# EAGLE design EasyBMS (EAGLE 9.6.2)
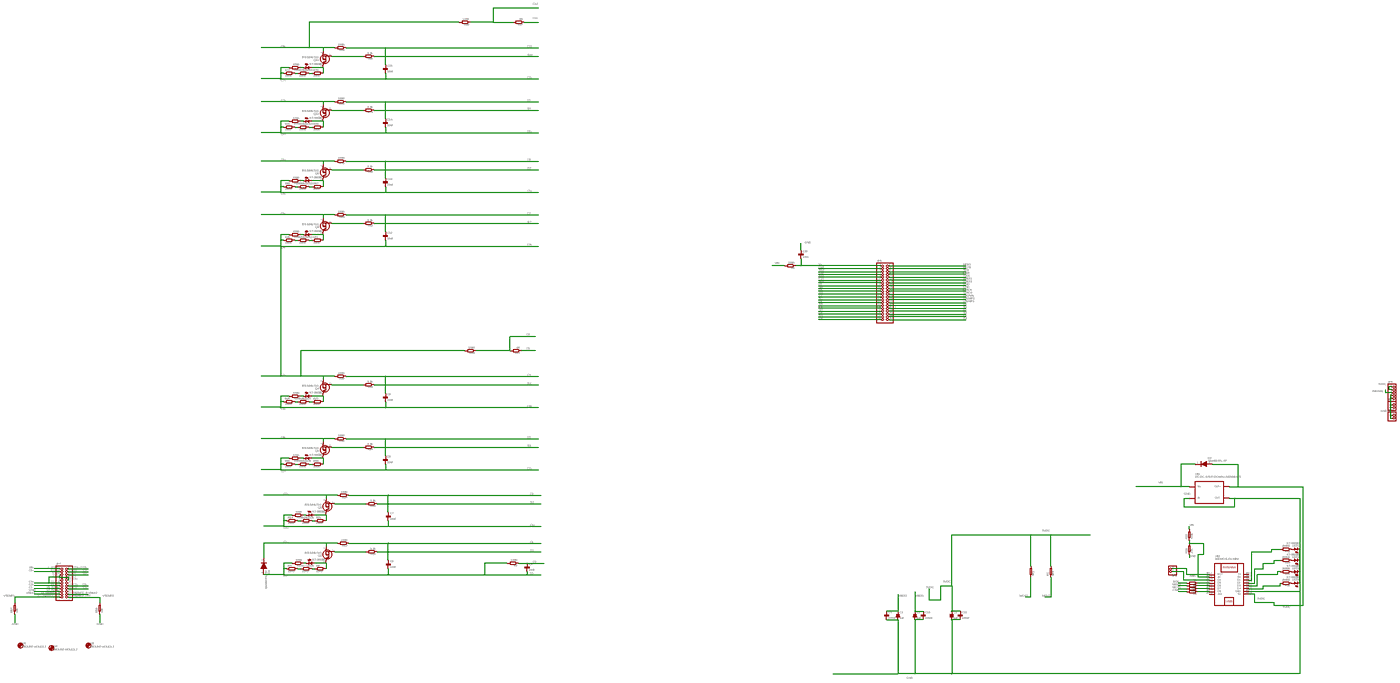
[diagram p0: schematic, sheet 1, overview]
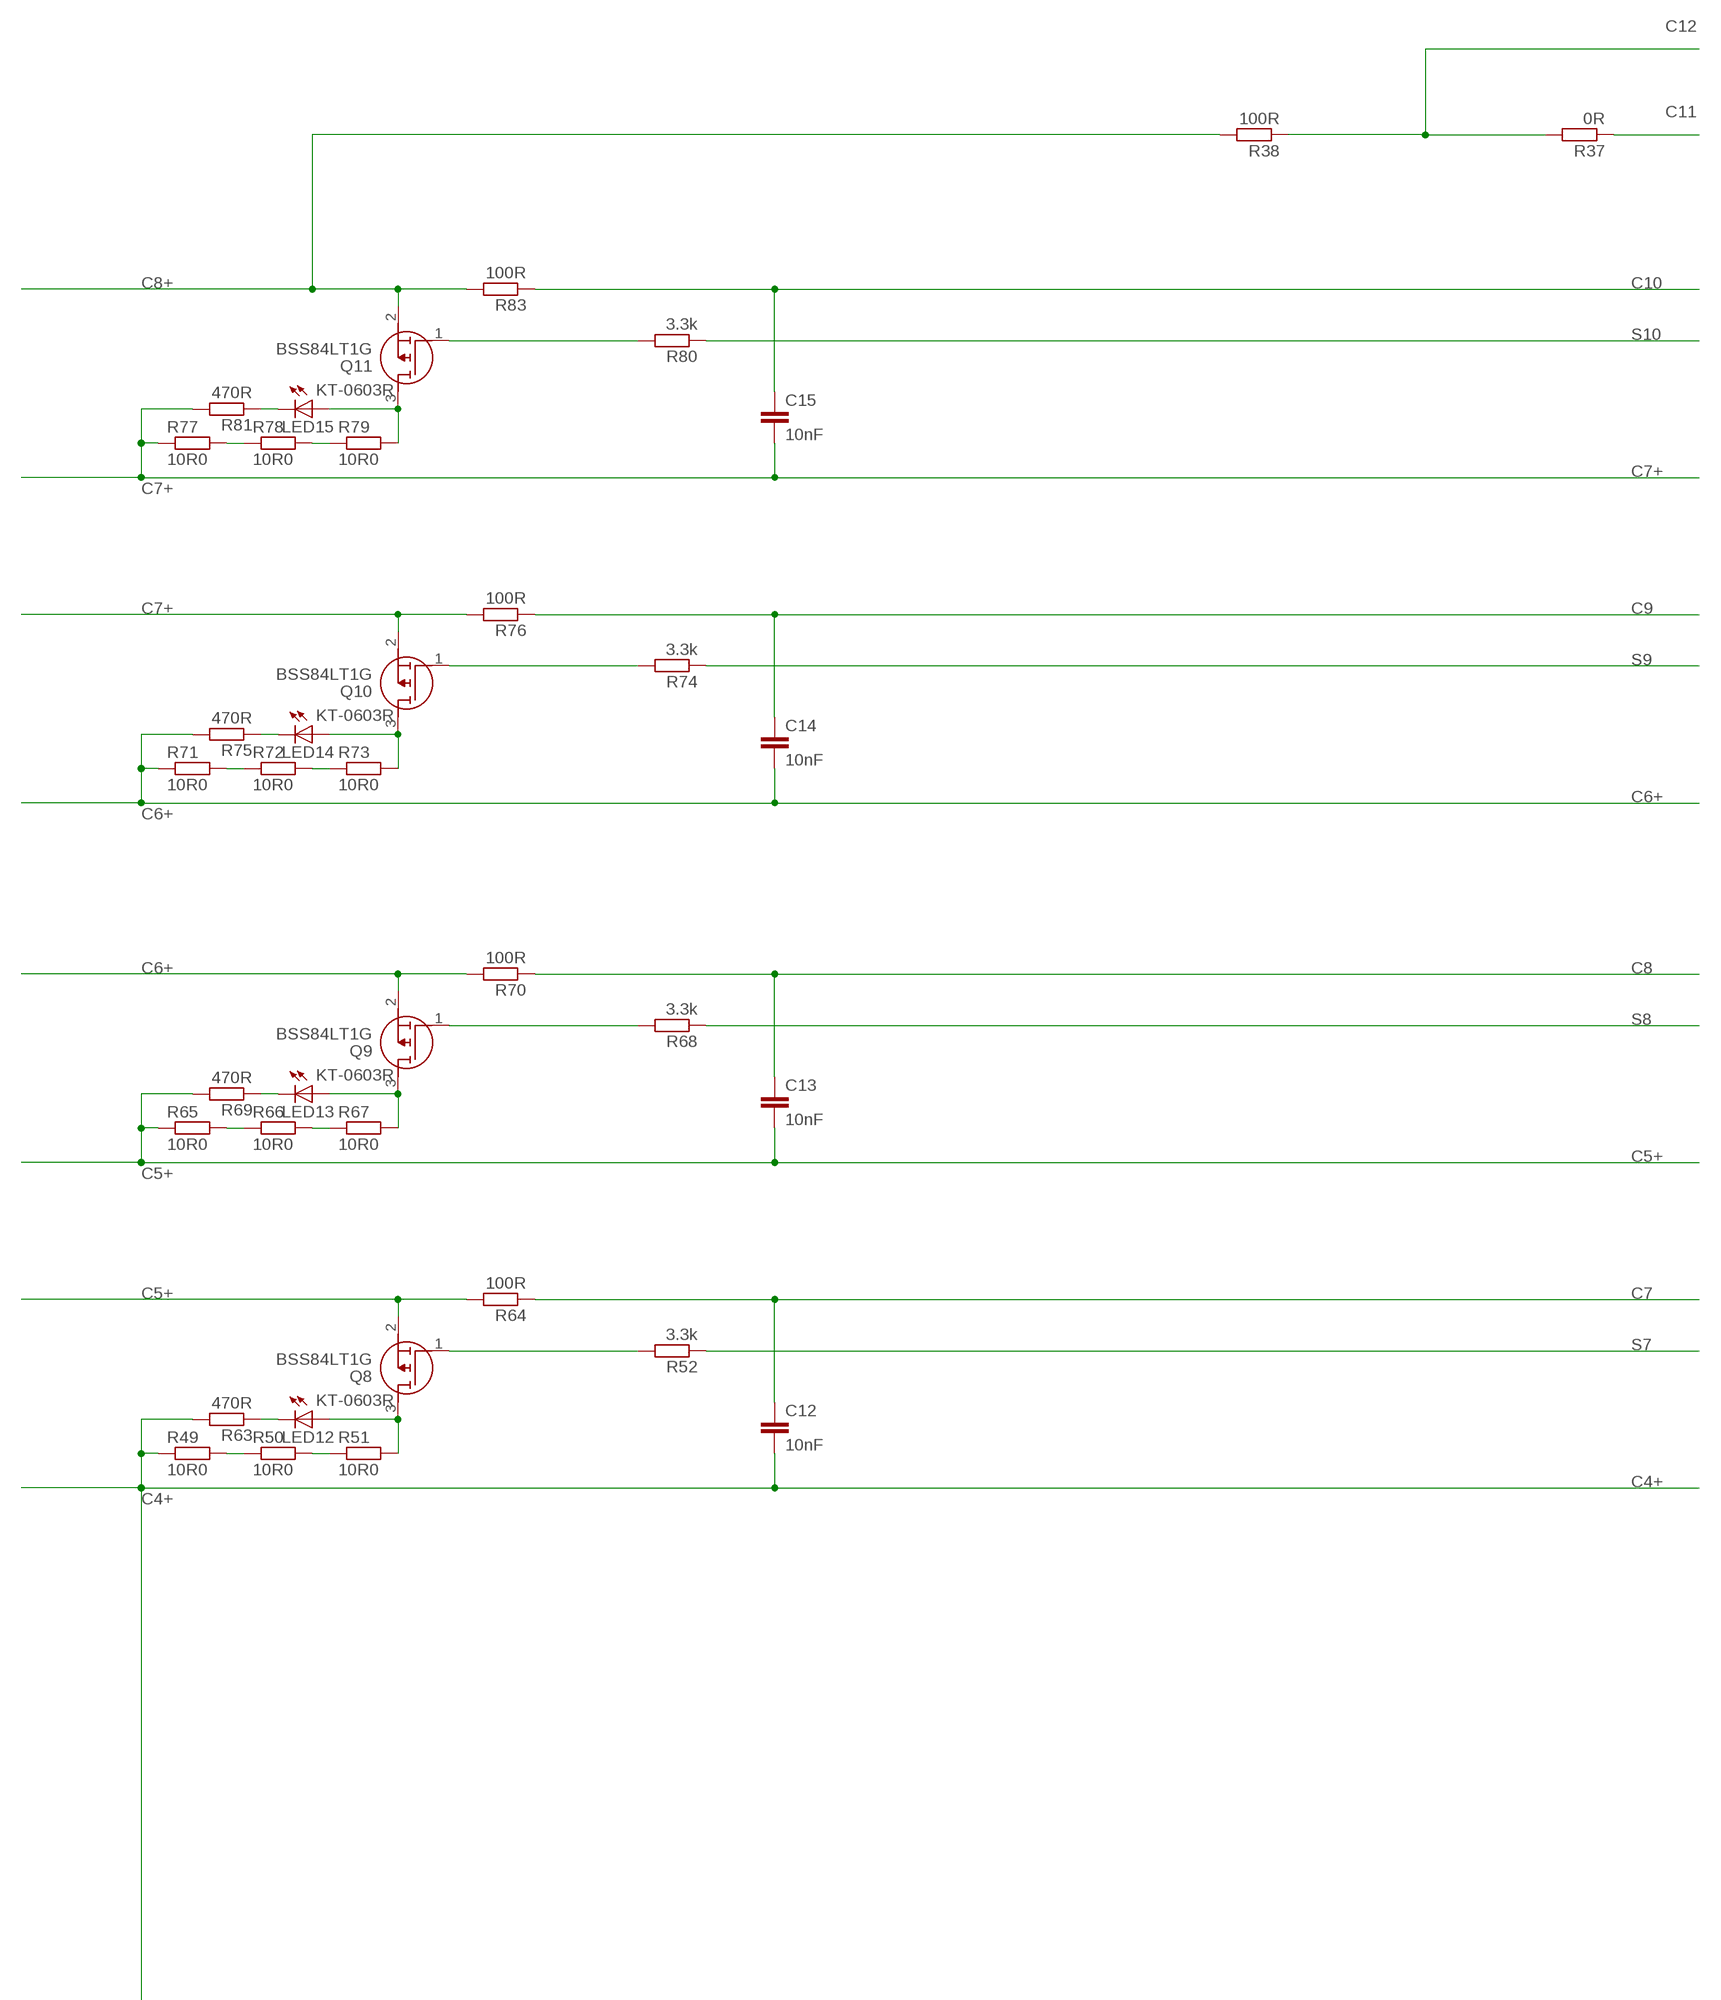
[diagram p1: schematic, sheet 1, part 1 of 4]
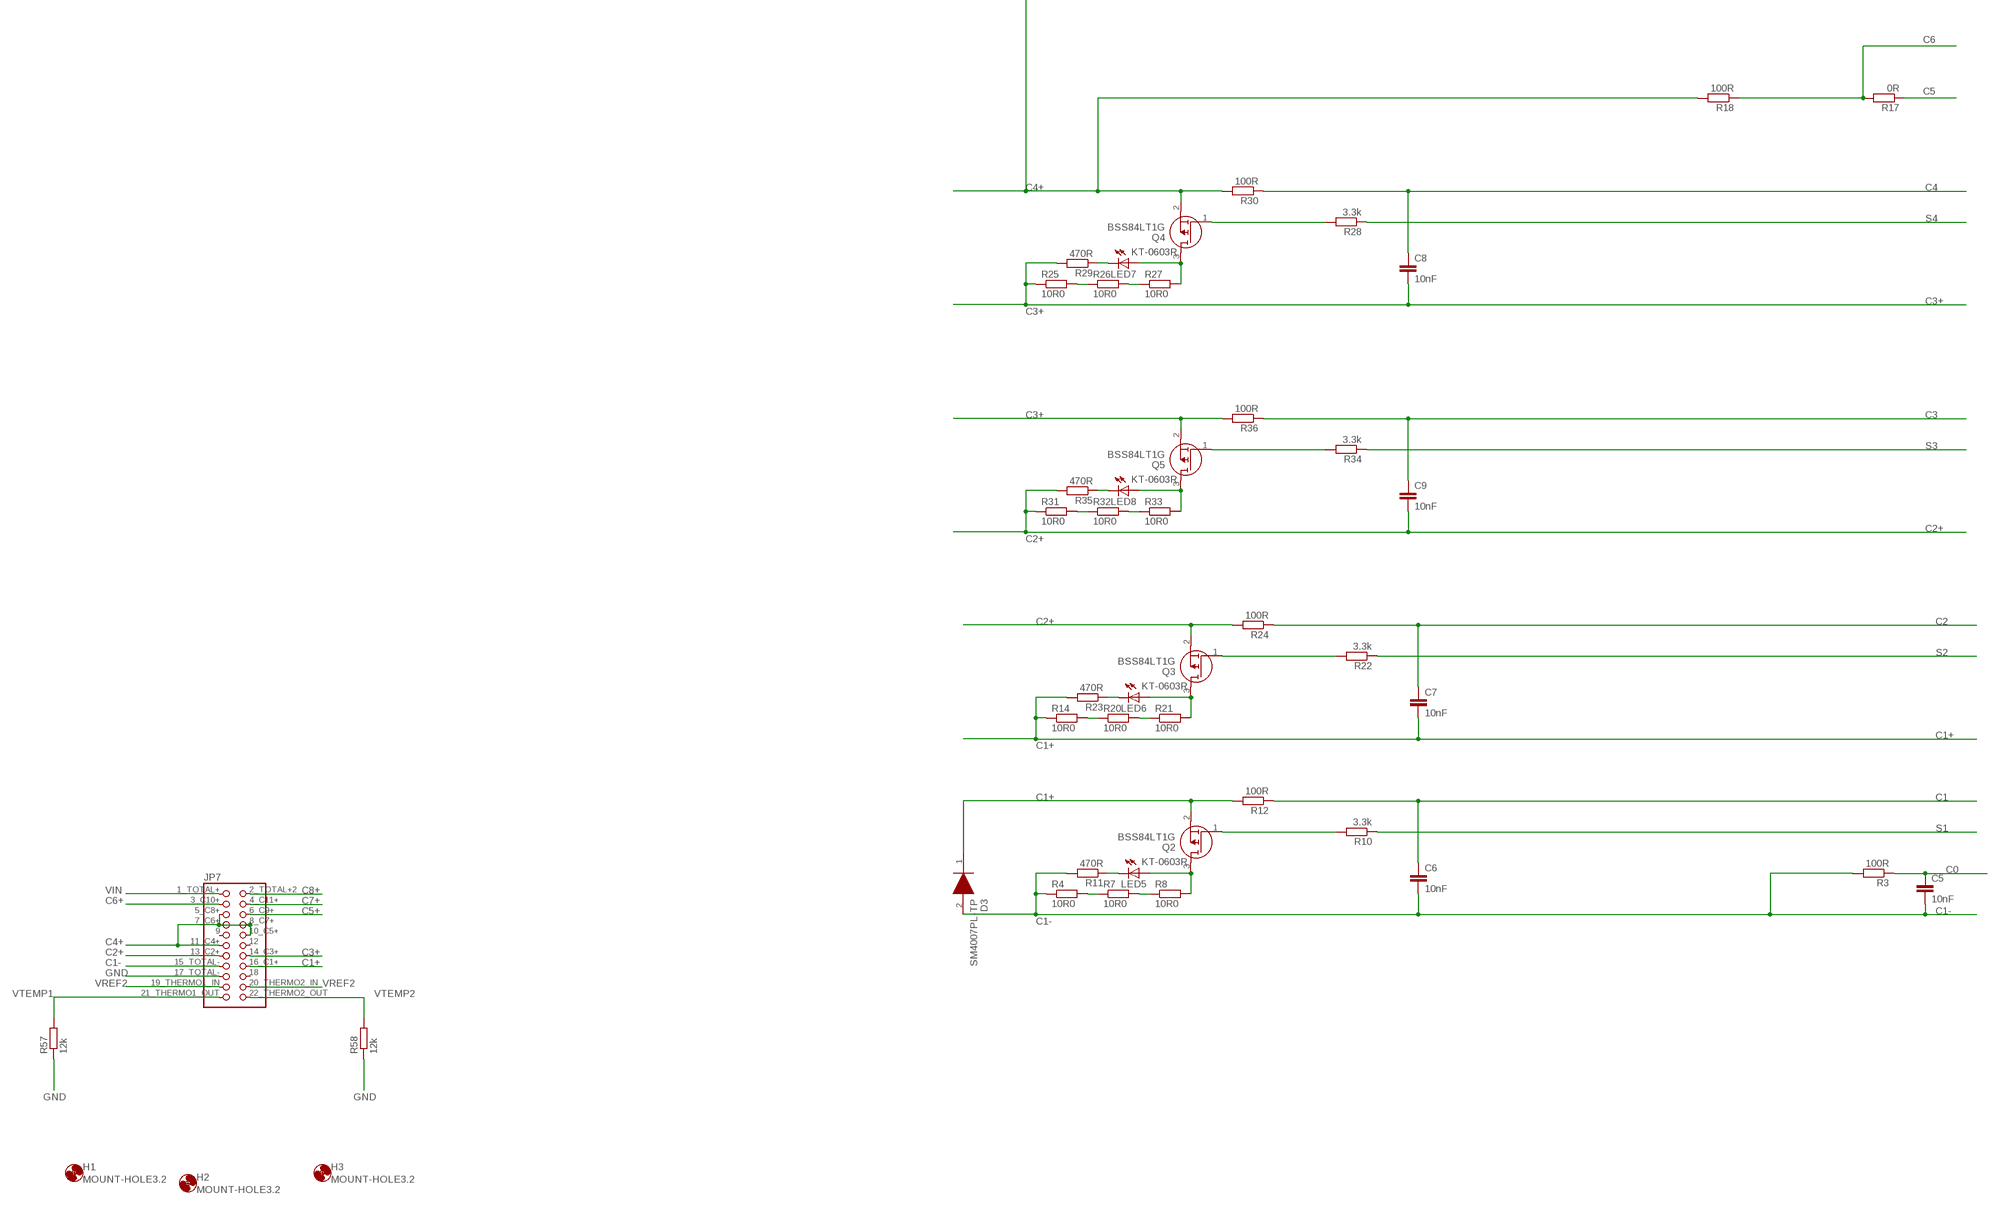
[diagram p2: schematic, sheet 1, part 2 of 4]
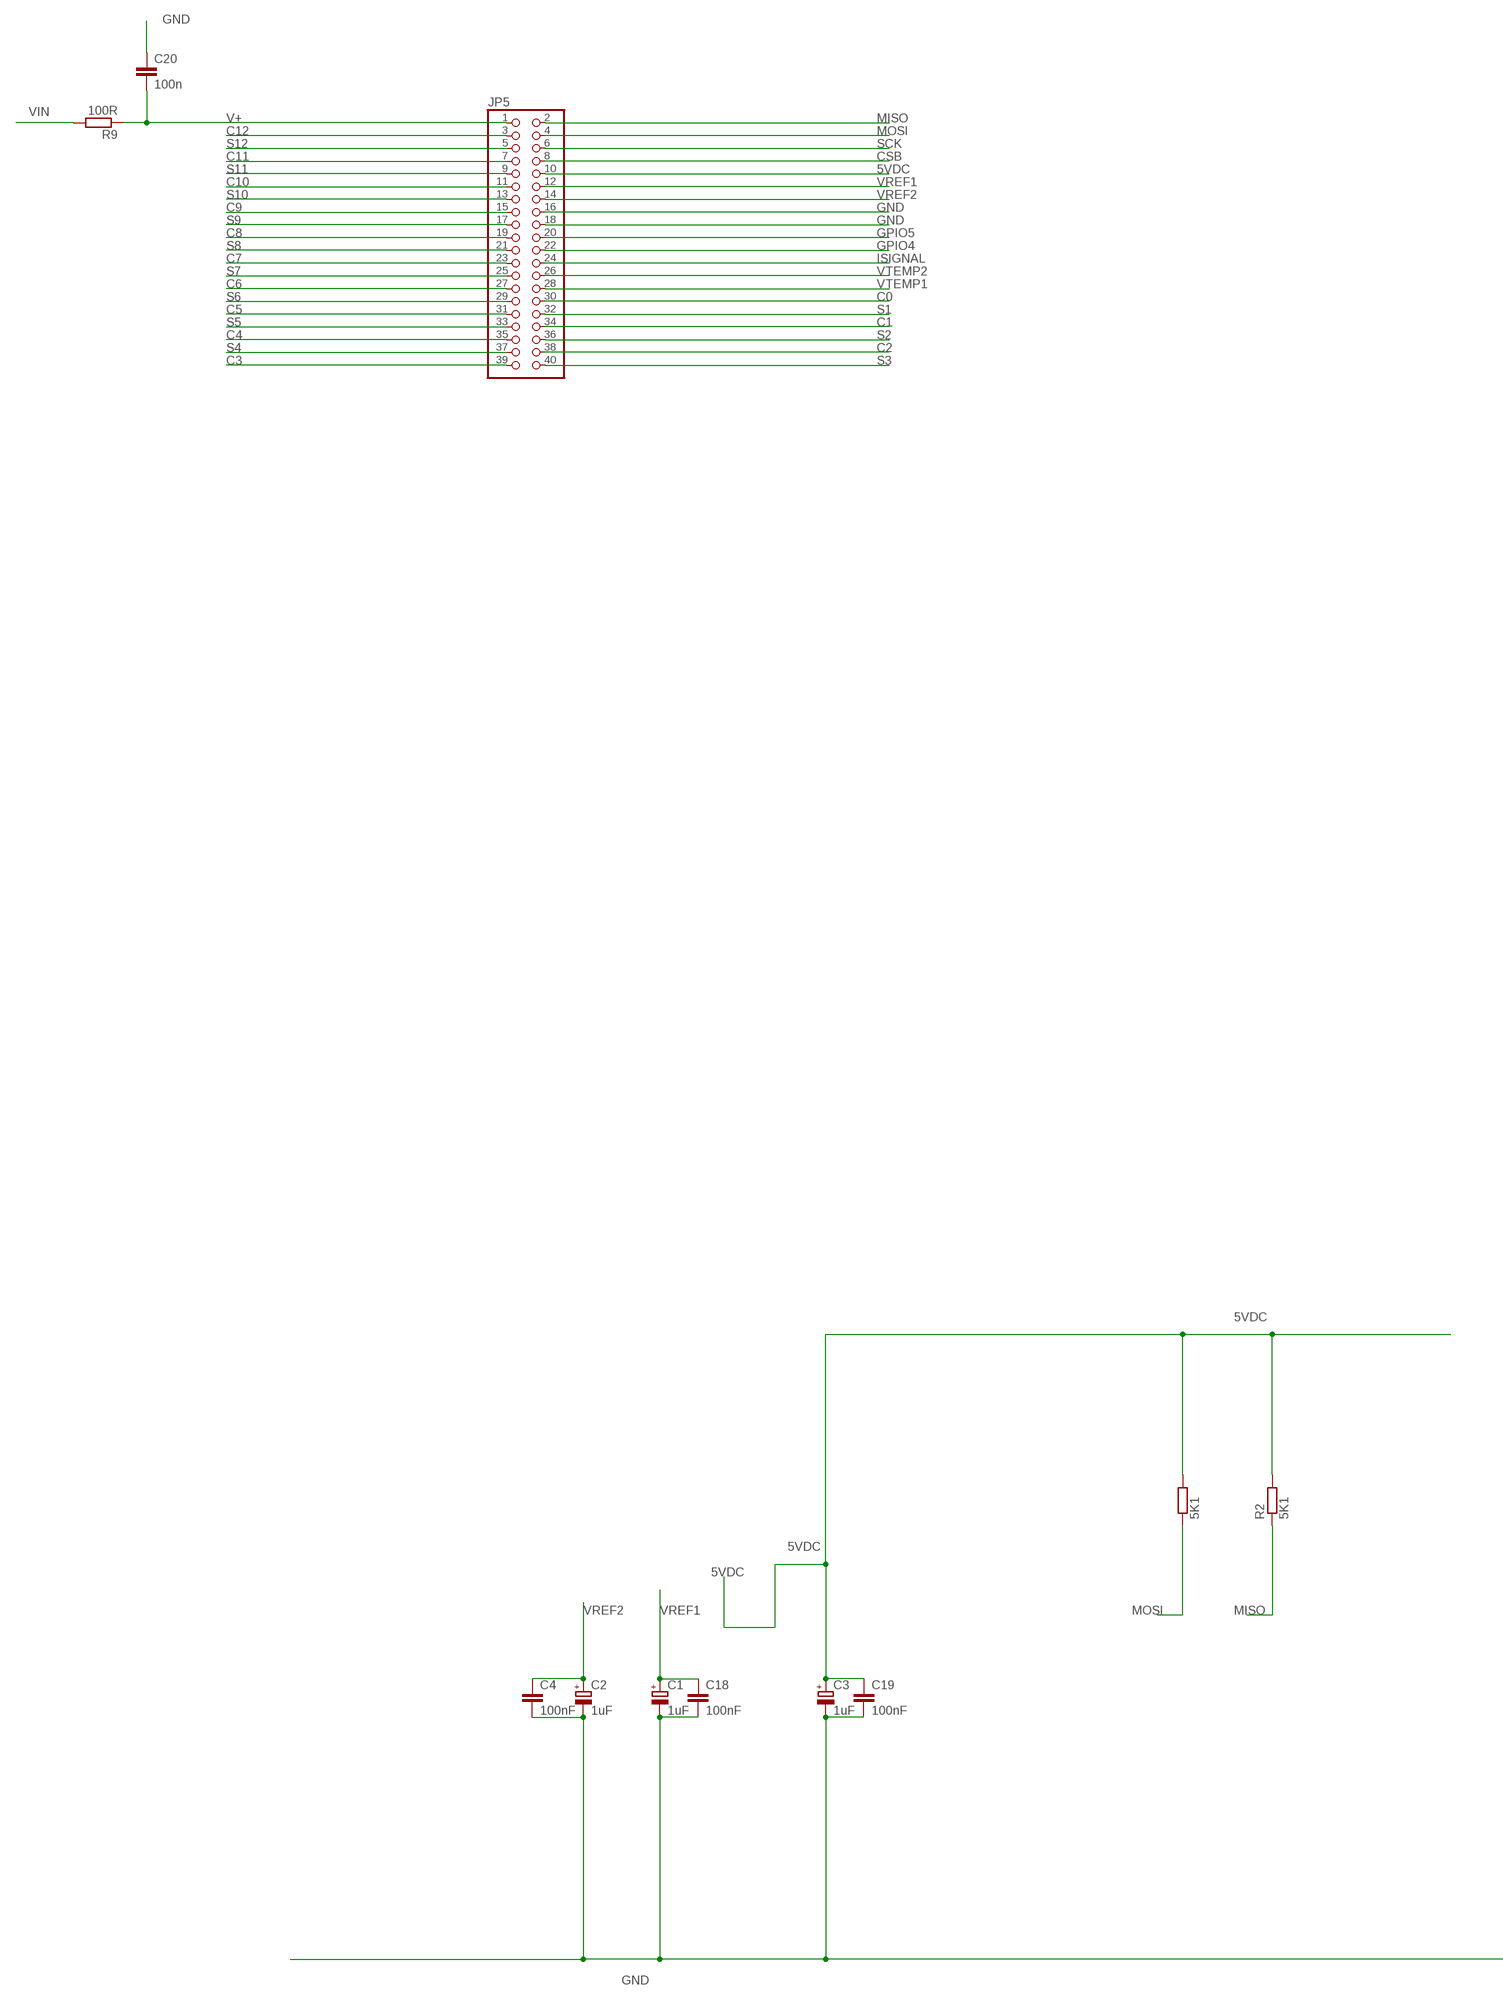
[diagram p3: schematic, sheet 1, part 3 of 4]
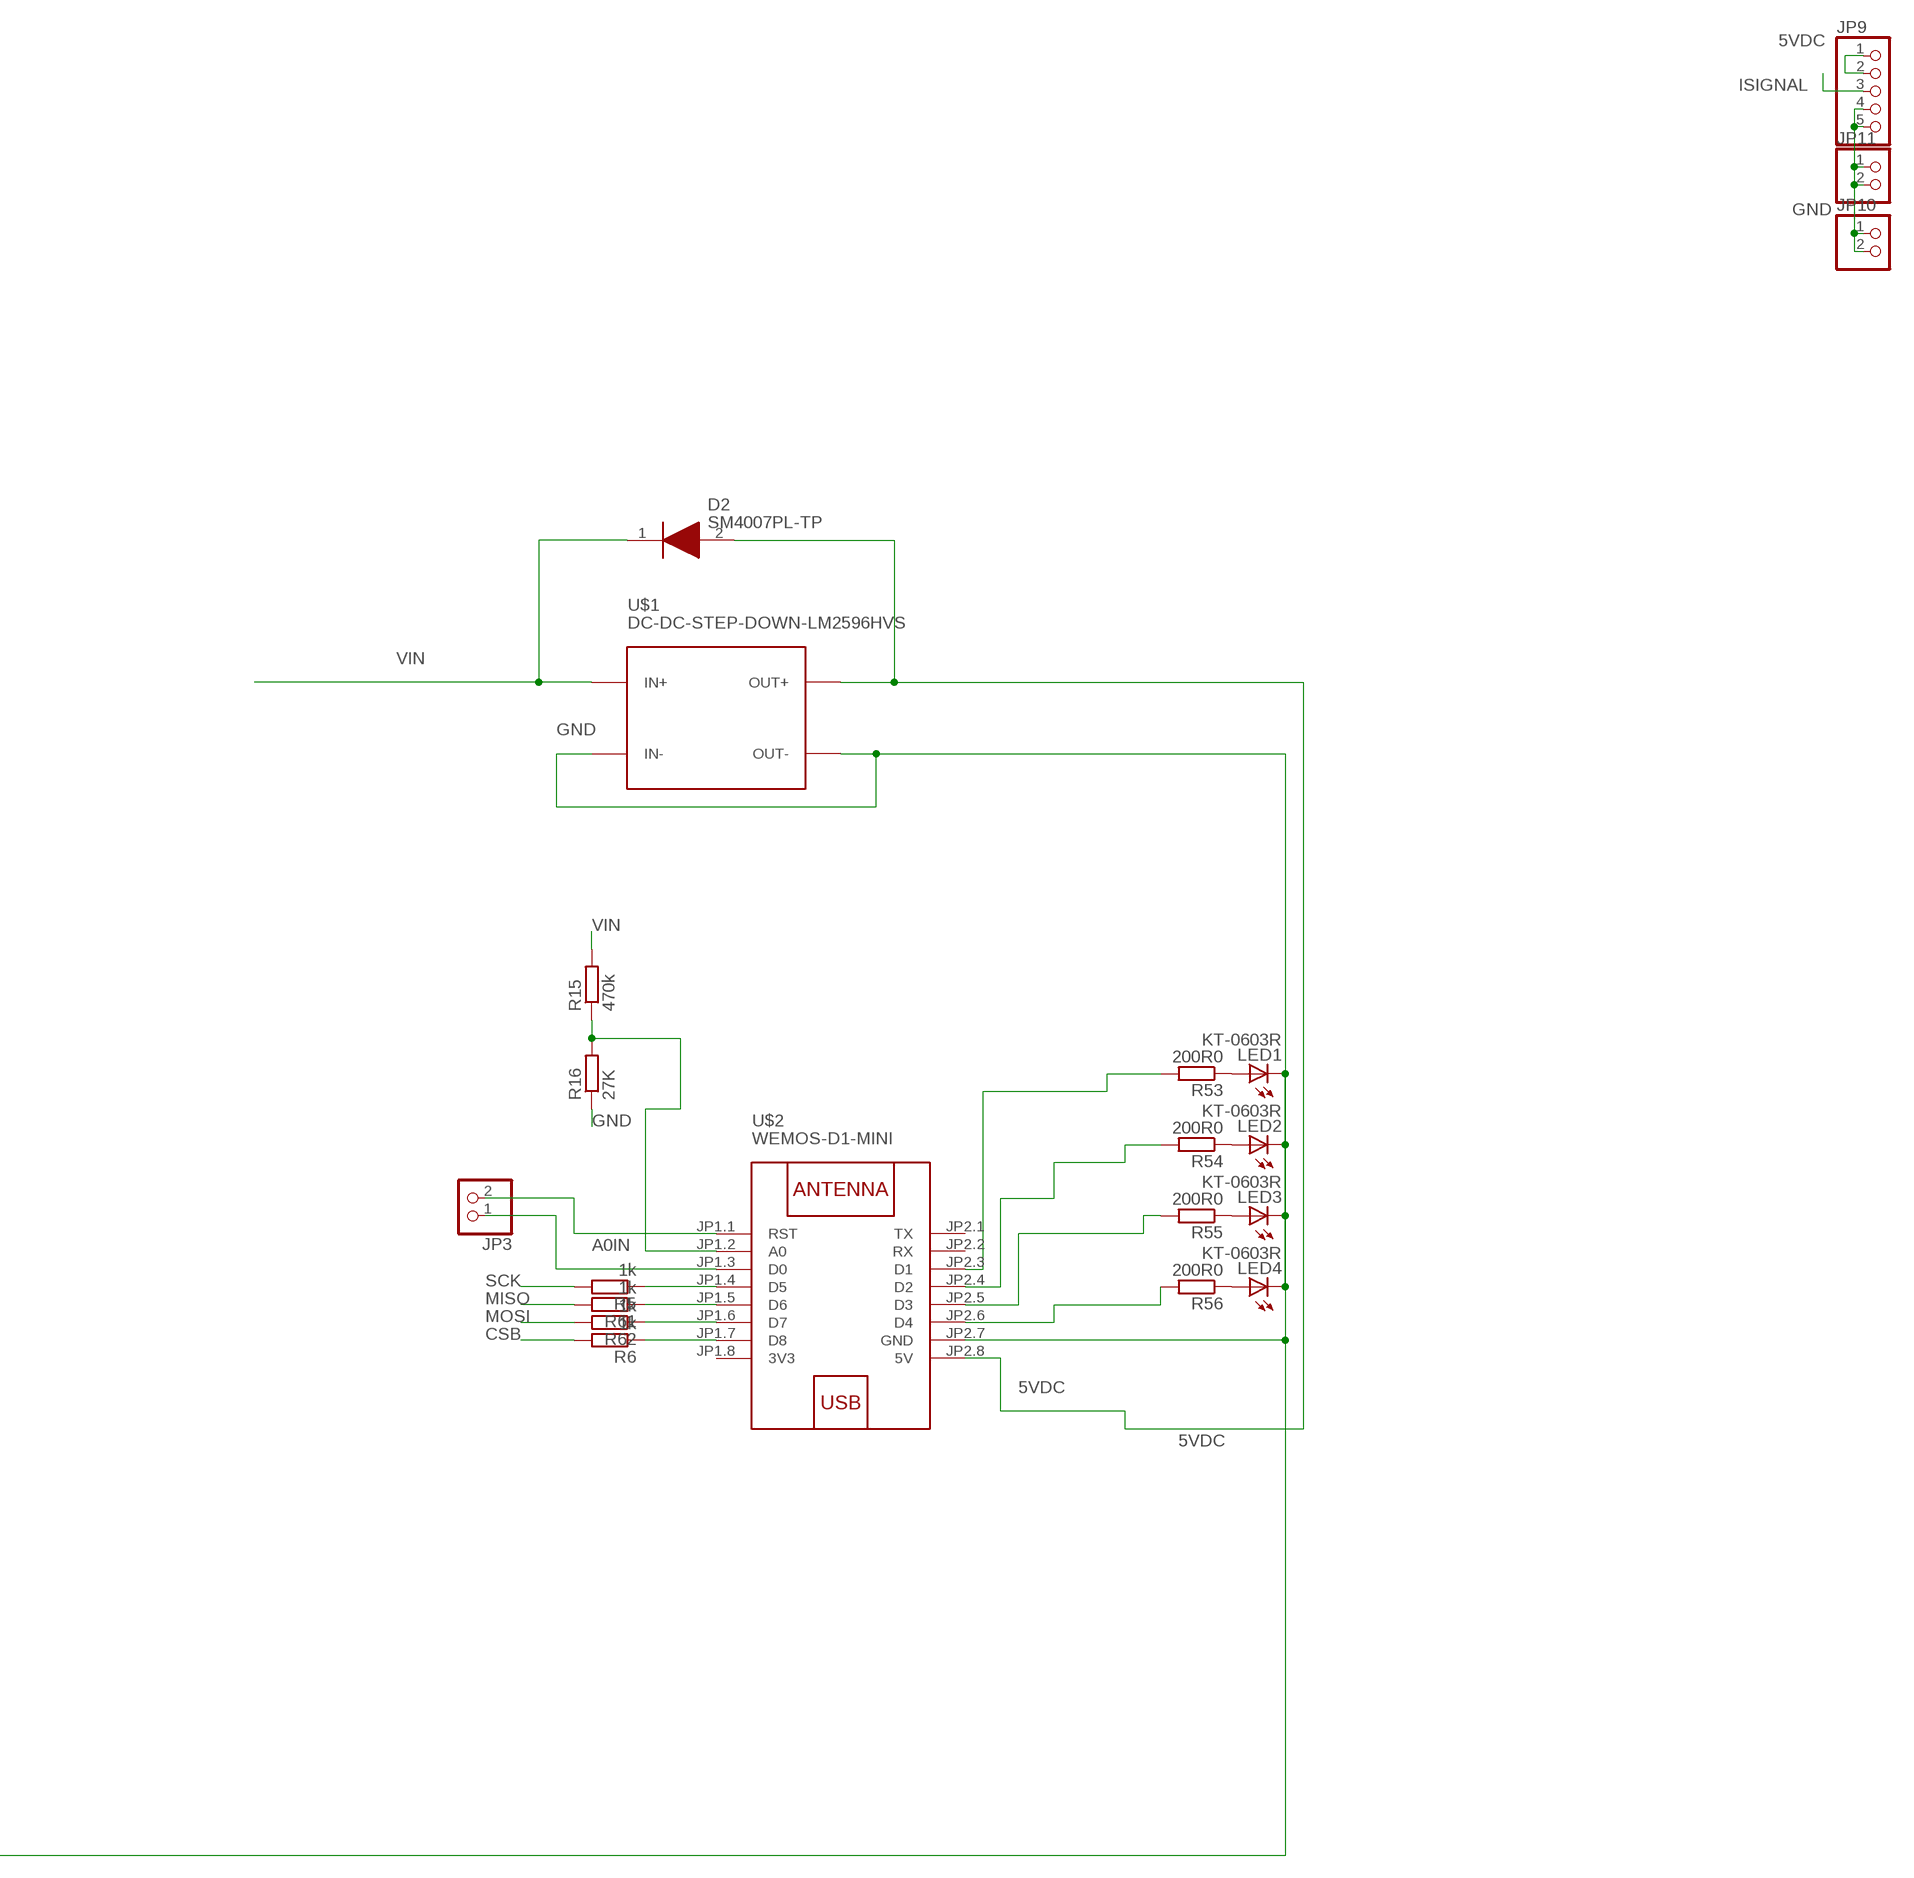
[diagram p4: schematic, sheet 1, part 4 of 4]

## Parts
C1  1uF  CPOL-EUE2.5-6  [E2,5-6]
C2  1uF  CPOL-EUE2.5-6  [E2,5-6]
C3  1uF  CPOL-EUE2.5-6  [E2,5-6]
C4  100nF  C-EUC1206  [C1206]
C5  10nF  C-EUC0402  [C0402]
C6  10nF  C-EUC0402  [C0402]
C7  10nF  C-EUC0402  [C0402]
C8  10nF  C-EUC0402  [C0402]
C9  10nF  C-EUC0402  [C0402]
C12  10nF  C-EUC0402  [C0402]
C13  10nF  C-EUC0402  [C0402]
C14  10nF  C-EUC0402  [C0402]
C15  10nF  C-EUC0402  [C0402]
C18  100nF  C-EUC1206  [C1206]
C19  100nF  C-EUC1206  [C1206]
C20  100n  C-EUC0402  [C0402]
D2  SM4007PL-TP  [SODFL3616X135N]
D3  SM4007PL-TP  [SODFL3616X135N]
H1  MOUNT-HOLE3.2  [3,2]
H2  MOUNT-HOLE3.2  [3,2]
H3  MOUNT-HOLE3.2  [3,2]
JP3  PINHD-1X2  [1X02]
JP5  PINHD-2X20  [2X20]
JP7  PINHD-2X11_MEB12S  [2X11_MEB12S]
JP9  PINHD-1X5  [1X05]
JP10  PINHD-1X2  [1X02]
JP11  PINHD-1X2  [1X02]
LED1  KT-0603R  LEDCHIPLED_0603  [CHIPLED_0603]
LED2  KT-0603R  LEDCHIPLED_0603  [CHIPLED_0603]
LED3  KT-0603R  LEDCHIPLED_0603  [CHIPLED_0603]
LED4  KT-0603R  LEDCHIPLED_0603  [CHIPLED_0603]
LED5  KT-0603R  LEDCHIPLED_0603  [CHIPLED_0603]
LED6  KT-0603R  LEDCHIPLED_0603  [CHIPLED_0603]
LED7  KT-0603R  LEDCHIPLED_0603  [CHIPLED_0603]
LED8  KT-0603R  LEDCHIPLED_0603  [CHIPLED_0603]
LED12  KT-0603R  LEDCHIPLED_0603  [CHIPLED_0603]
LED13  KT-0603R  LEDCHIPLED_0603  [CHIPLED_0603]
LED14  KT-0603R  LEDCHIPLED_0603  [CHIPLED_0603]
LED15  KT-0603R  LEDCHIPLED_0603  [CHIPLED_0603]
Q2  BSS84LT1G  [SOT96P237X111-3N]
Q3  BSS84LT1G  [SOT96P237X111-3N]
Q4  BSS84LT1G  [SOT96P237X111-3N]
Q5  BSS84LT1G  [SOT96P237X111-3N]
Q8  BSS84LT1G  [SOT96P237X111-3N]
Q9  BSS84LT1G  [SOT96P237X111-3N]
Q10  BSS84LT1G  [SOT96P237X111-3N]
Q11  BSS84LT1G  [SOT96P237X111-3N]
R1  5K1  R-EU_R0603  [R0603]
R2  5K1  R-EU_R0603  [R0603]
R3  100R  R-EU_R0402  [R0402]
R4  10R0  R-EU_R1206  [R1206]
R5  1k  R-EU_R0603  [R0603]
R6  1k  R-EU_R0603  [R0603]
R7  10R0  R-EU_R1206  [R1206]
R8  10R0  R-EU_R1206  [R1206]
R9  100R  R-EU_R0402  [R0402]
R10  3.3k  R-EU_R0402  [R0402]
R11  470R  R-EU_R0402  [R0402]
R12  100R  R-EU_R0402  [R0402]
R14  10R0  R-EU_R1206  [R1206]
R15  470k  R-EU_R0603  [R0603]
R16  27K  R-EU_R0603  [R0603]
R17  0R  R-EU_R0402  [R0402]
R18  100R  R-EU_R0402  [R0402]
R20  10R0  R-EU_R1206  [R1206]
R21  10R0  R-EU_R1206  [R1206]
R22  3.3k  R-EU_R0402  [R0402]
R23  470R  R-EU_R0402  [R0402]
R24  100R  R-EU_R0402  [R0402]
R25  10R0  R-EU_R1206  [R1206]
R26  10R0  R-EU_R1206  [R1206]
R27  10R0  R-EU_R1206  [R1206]
R28  3.3k  R-EU_R0402  [R0402]
R29  470R  R-EU_R0402  [R0402]
R30  100R  R-EU_R0402  [R0402]
R31  10R0  R-EU_R1206  [R1206]
R32  10R0  R-EU_R1206  [R1206]
R33  10R0  R-EU_R1206  [R1206]
R34  3.3k  R-EU_R0402  [R0402]
R35  470R  R-EU_R0402  [R0402]
R36  100R  R-EU_R0402  [R0402]
R37  0R  R-EU_R0402  [R0402]
R38  100R  R-EU_R0402  [R0402]
R49  10R0  R-EU_R1206  [R1206]
R50  10R0  R-EU_R1206  [R1206]
R51  10R0  R-EU_R1206  [R1206]
R52  3.3k  R-EU_R0402  [R0402]
R53  200R0  R-EU_R0603  [R0603]
R54  200R0  R-EU_R0603  [R0603]
R55  200R0  R-EU_R0603  [R0603]
R56  200R0  R-EU_R0603  [R0603]
R57  12k  R-EU_R0603  [R0603]
R58  12k  R-EU_R0603  [R0603]
R61  1k  R-EU_R0603  [R0603]
R62  1k  R-EU_R0603  [R0603]
R63  470R  R-EU_R0402  [R0402]
R64  100R  R-EU_R0402  [R0402]
R65  10R0  R-EU_R1206  [R1206]
R66  10R0  R-EU_R1206  [R1206]
R67  10R0  R-EU_R1206  [R1206]
R68  3.3k  R-EU_R0402  [R0402]
R69  470R  R-EU_R0402  [R0402]
R70  100R  R-EU_R0402  [R0402]
R71  10R0  R-EU_R1206  [R1206]
R72  10R0  R-EU_R1206  [R1206]
R73  10R0  R-EU_R1206  [R1206]
R74  3.3k  R-EU_R0402  [R0402]
R75  470R  R-EU_R0402  [R0402]
R76  100R  R-EU_R0402  [R0402]
R77  10R0  R-EU_R1206  [R1206]
R78  10R0  R-EU_R1206  [R1206]
R79  10R0  R-EU_R1206  [R1206]
R80  3.3k  R-EU_R0402  [R0402]
R81  470R  R-EU_R0402  [R0402]
R83  100R  R-EU_R0402  [R0402]
U$1  DC-DC-STEP-DOWN-LM2596HVS  [DC-DC-STEP-DOWN-LM2596HVS]
U$2  WEMOS-D1-MINI  [WEMOS-D1-MINI]

## Nets
5VDC: C3.+ C19.1 D2.2(A) JP5.10 JP9.1 JP9.2 R1.2 R2.2 U$1.OUT+ U$2.JP2.8(5V)
A0IN: R15.1 R16.2 U$2.JP1.2(A0)
C0: C5.1 JP5.30 R3.1
C1: C6.1 JP5.34 R12.1
C1+: C7.2 D3.1(K) JP7.16_C1+ Q2.2(S) R12.2 R14.1 R23.2
C1-: C5.2 C6.2 D3.2(A) JP7.15_TOTAL- R3.2 R4.1 R11.2
C2: C7.1 JP5.38 R24.1
C2+: C9.2 JP7.13_C2+ Q3.2(S) R24.2 R31.1 R35.2
C3: C9.1 JP5.39 R36.1
C3+: C8.2 JP7.14_C3+ Q5.2(S) R25.1 R29.2 R36.2
C4: C8.1 JP5.35 R30.1
C4+: C12.2 JP7.5_C8+ JP7.7_C6+ JP7.8_C7+ JP7.10_C5+ JP7.11_C4+ Q4.2(S) R18.2 R30.2 R49.1 R63.2
C5: JP5.31 R17.1
C5+: C13.2 JP7.6_C9+ Q8.2(S) R64.2 R65.1 R69.2
C6: JP5.27 R17.2 R18.1
C6+: C14.2 JP7.3_C10+ Q9.2(S) R70.2 R71.1 R75.2
C7: C12.1 JP5.23 R64.1
C7+: C15.2 JP7.4_C11+ Q10.2(S) R76.2 R77.1 R81.2
C8: C13.1 JP5.19 R70.1
C8+: JP7.2_TOTAL+2(2_CTOTAL+) Q11.2(S) R38.2 R83.2
C9: C14.1 JP5.15 R76.1
C10: C15.1 JP5.11 R83.1
C11: JP5.7 R37.1
C12: JP5.3 R37.2 R38.1
CSB: JP5.8 R6.2
GND: C1.- C2.- C3.- C4.2 C18.2 C19.2 C20.1 JP5.16 JP5.18 JP7.17_TOTAL-(TOTAL-) JP9.4 JP9.5 JP10.1 JP10.2 JP11.1 JP11.2 LED1.C LED2.C LED3.C LED4.C R16.1 R57.1 R58.1 U$1.IN- U$1.OUT- U$2.JP2.7(GND)
GPIO4: JP5.22
GPIO5: JP5.20
ISIGNAL: JP5.24 JP9.3
MISO: JP5.2 R2.1 R61.2
MOSI: JP5.4 R1.1 R62.2
N$1: LED1.A R53.1
N$2: LED2.A R54.1
N$3: LED3.A R55.1
N$4: LED4.A R56.1
N$5: JP3.2 U$2.JP1.1(RST)
N$6: JP3.1 U$2.JP1.3(D0)
N$7: R5.1 U$2.JP1.4(D5)
N$8: R4.2 R7.1
N$9: R7.2 R8.1
N$10: LED5.A Q2.3(D) R8.2
N$11: Q2.1(G) R10.2
N$12: LED5.C R11.1
N$13: R14.2 R20.1
N$14: R20.2 R21.1
N$15: R6.1 U$2.JP1.7(D8)
N$16: LED6.A Q3.3(D) R21.2
N$19: Q3.1(G) R22.2
N$20: LED6.C R23.1
N$21: R25.2 R26.1
N$22: R26.2 R27.1
N$23: LED7.A Q4.3(D) R27.2
N$24: Q4.1(G) R28.2
N$26: LED7.C R29.1
N$27: R31.2 R32.1
N$28: R32.2 R33.1
N$29: LED8.A Q5.3(D) R33.2
N$30: R56.2 U$2.JP2.6(D4)
N$31: Q5.1(G) R34.2
N$32: LED8.C R35.1
N$43: R49.2 R50.1
N$44: R50.2 R51.1
N$45: LED12.A Q8.3(D) R51.2
N$46: Q8.1(G) R52.2
N$47: LED12.C R63.1
N$48: R65.2 R66.1
N$49: R66.2 R67.1
N$50: LED13.A Q9.3(D) R67.2
N$51: Q9.1(G) R68.2
N$52: LED13.C R69.1
N$53: R71.2 R72.1
N$54: R72.2 R73.1
N$55: LED14.A Q10.3(D) R73.2
N$56: Q10.1(G) R74.2
N$57: LED14.C R75.1
N$58: R77.2 R78.1
N$59: R78.2 R79.1
N$60: LED15.A Q11.3(D) R79.2
N$61: Q11.1(G) R80.2
N$62: LED15.C R81.1
N$70: R53.2 U$2.JP2.3(D1)
N$73: R61.1 U$2.JP1.5(D6)
N$119: R62.1 U$2.JP1.6(D7)
N$120: R55.2 U$2.JP2.5(D3)
N$124: R54.2 U$2.JP2.4(D2)
S1: JP5.32 R10.1
S2: JP5.36 R22.1
S3: JP5.40 R34.1
S4: JP5.37 R28.1
S5: JP5.33
S6: JP5.29
S7: JP5.25 R52.1
S8: JP5.21 R68.1
S9: JP5.17 R74.1
S10: JP5.13 R80.1
S11: JP5.9
S12: JP5.5
SCK: JP5.6 R5.2
V+: C20.2 JP5.1 R9.1
VIN: D2.1(K) JP7.1_TOTAL+ R9.2 R15.2 U$1.IN+
VREF1: C1.+ C18.1 JP5.12
VREF2: C2.+ C4.1 JP5.14 JP7.19_THERMO1_IN JP7.20_THERMO2_IN
VTEMP1: JP5.28 JP7.21_THERMO1_OUT R57.2
VTEMP2: JP5.26 JP7.22_THERMO2_OUT R58.2
Unconnected: JP7.9 JP7.12 JP7.18 U$2.JP2.1(TX) U$2.JP2.2(RX)

## Power pins joined to a net without a drawn wire
3V3: U$2.JP1.8(3V3)

## Library data of the parts
C1-C3 = rcl:CPOL-EU: POLARIZED CAPACITOR, European symbol
C4-C9 C12-C15 C18-C20 = rcl:C-EU: CAPACITOR, European symbol
D2 D3 = SamacSys_Parts:SM4007PL-TP: Rectifiers 1A, 1000V 1A, 1000V Source: Datasheet <http://www.mccsemi.com/up_pdf/SM4001PL-SM4007PL(SOD-123FL).PDF>; DESCRIPTION: Rectifiers 1A, 1000V 1A, 1000V; HEIGHT: 1.35mm; MANUFACTURER_NAME: Micro Commercial Components (MCC); MANUFACTURER_PART_NUMBER: SM4007PL-TP; MOUSER_PART_NUMBER: 833-SM4007PL-TP; MOUSER_PRICE-STOCK: https://www.mouser.co.uk/ProductDetail/Micro-Commercial-Components-MCC/SM4007PL-TP?qs=SdqRYZZ9IxCh9ylwm1K3UA%3D%3D
H1-H3 = holes:MOUNT-HOLE: MOUNTING HOLE with drill center marker
JP3 = pinhead_own:PINHD-1X2: PIN HEADER
JP5 = pinhead:PINHD-2X20: PIN HEADER
JP7 = pinhead_own:PINHD-2X11_MEB12S: PIN HEADER
JP9 = pinhead:PINHD-1X5: PIN HEADER
JP10 JP11 = pinhead:PINHD-1X2: PIN HEADER
LED1-LED8 LED12-LED15 = led:LED: LED OSRAM: - CHIPLED LG R971, LG N971, LY N971, LG Q971, LY Q971, LO R971, LY R971 LH N974, LH R974 LS Q976, LO Q976, LY Q976 LO Q996 - Hyper CHIPLED LW Q18S LB Q993, LB Q99A, LB R99A - SideLED LS A670, LO A670, LY A670, LG A670, LP A670 LB A673, LV A673, LT A673, LW A673 LH A674 LY A675 LS A676, LA A676, LO A676, LY A676, LW A676 LS A679, LY A679, LG A679 - Hyper Micro SIDELED® LS Y876, LA Y876, LO Y876, LY Y876 LT Y87S - SmartLED LW L88C, LW L88S LB L89C, LB L89S, LG L890 LS L89K, LO L89K, LY L89K LS L896, LA L896, LO L896, LY L896 - TOPLED LS T670, LO T670, LY T670, LG T670, LP T670 LSG T670, LSP T670, LSY T670, LOP T670, LYG T670 LG T671, LOG T671, LSG T671 LB T673, LV T673, LT T673, LW T673 LH T674 LS T676, LA T676, LO T676, LY T676, LB T676, LH T676, LSB T676, LW T676 LB T67C, LV T67C, LT T67C, LS T67K, LO T67K, LY T67K, LW E67C LS E67B, LA E67B, LO E67B, LY E67B, LB E67C, LV E67C, LT E67C LW T67C LS T679, LY T679, LG T679 LS T770, LO T770, LY T770, LG T770, LP T770 LB T773, LV T773, LT T773, LW T773 LH T774 LS E675, LA E675, LY E675, LS T675 LS T776, LA T776, LO T776, LY T776, LB T776 LHGB T686 LT T68C, LB T68C - Hyper Mini TOPLED® LB M676 - Mini TOPLED Santana® LG M470 LS M47K, LO M47K, LY M47K Source: http://www.osram.convergy.de LUXEON: - LUMILED® LXK2-PW12-R00, LXK2-PW12-S00, LXK2-PW14-U00, LXK2-PW14-V00 LXK2-PM12-R00, LXK2-PM12-S00, LXK2-PM14-U00 LXK2-PE12-Q00, LXK2-PE12-R00, LXK2-PE12-S00, LXK2-PE14-T00, LXK2-PE14-U00 LXK2-PB12-K00, LXK2-PB12-L00, LXK2-PB12-M00, LXK2-PB14-N00, LXK2-PB14-P00, LXK2-PB14-Q00 LXK2-PR12-L00, LXK2-PR12-M00, LXK2-PR14-Q00, LXK2-PR14-R00 LXK2-PD12-Q00, LXK2-PD12-R00, LXK2-PD12-S00 LXK2-PH12-R00, LXK2-PH12-S00 LXK2-PL12-P00, LXK2-PL12-Q00, LXK2-PL12-R00 Source: www.luxeon.com KINGBRIGHT: KA-3528ASYC Source: www.kingbright.com
Q2-Q5 Q8-Q11 = SamacSys_Parts:BSS84LT1G: MOSFET 50V 130mA P-Channel Source: Datasheet <http://www.onsemi.com/pub/Collateral/BSS84LT1-D.PDF>; DESCRIPTION: MOSFET 50V 130mA P-Channel; HEIGHT: 1.11mm; MANUFACTURER_NAME: ON Semiconductor; MANUFACTURER_PART_NUMBER: BSS84LT1G; MOUSER_PART_NUMBER: 863-BSS84LT1G; MOUSER_PRICE-STOCK: https://www.mouser.co.uk/ProductDetail/ON-Semiconductor/BSS84LT1G?qs=vNc2DXHODiKIGu9QIvMAfw%3D%3D
R1-R12 R14-R18 R20-R38 R49-R58 R61-R81 R83 = rcl:R-EU_: RESISTOR, European symbol
U$1 = diy-modules:DC-DC-STEP-DOWN-LM2596HVS: DC/DC Step-Down Regulator based on LM2596-ADJ chip LM2596 datasheet available here: http://www.ti.com/lit/ds/symlink/lm2596.pdf Click here to find device on ebay.com <http://www.ebay.com/sch/lm2596+power+regulator>
U$2 = diy-modules:WEMOS-D1-MINI: WEMOS D1 mini: Mini Wi-Fi Board based on ESP-8266 device More details can be found here: https://www.wemos.cc/product/d1-mini.html Click here to find device on ebay.com <http://www.ebay.com/sch/wemos+d1+mini+nodemcu>

## Board
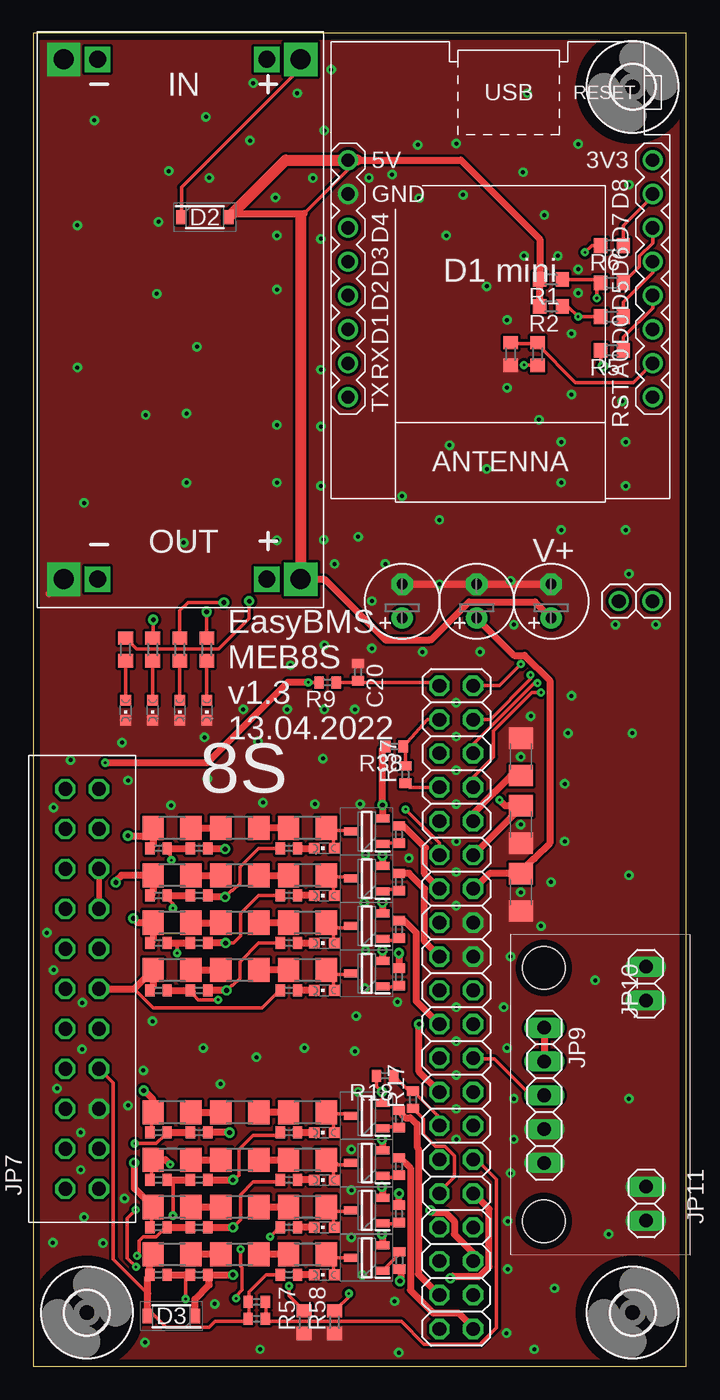
[diagram p5: board, top side]
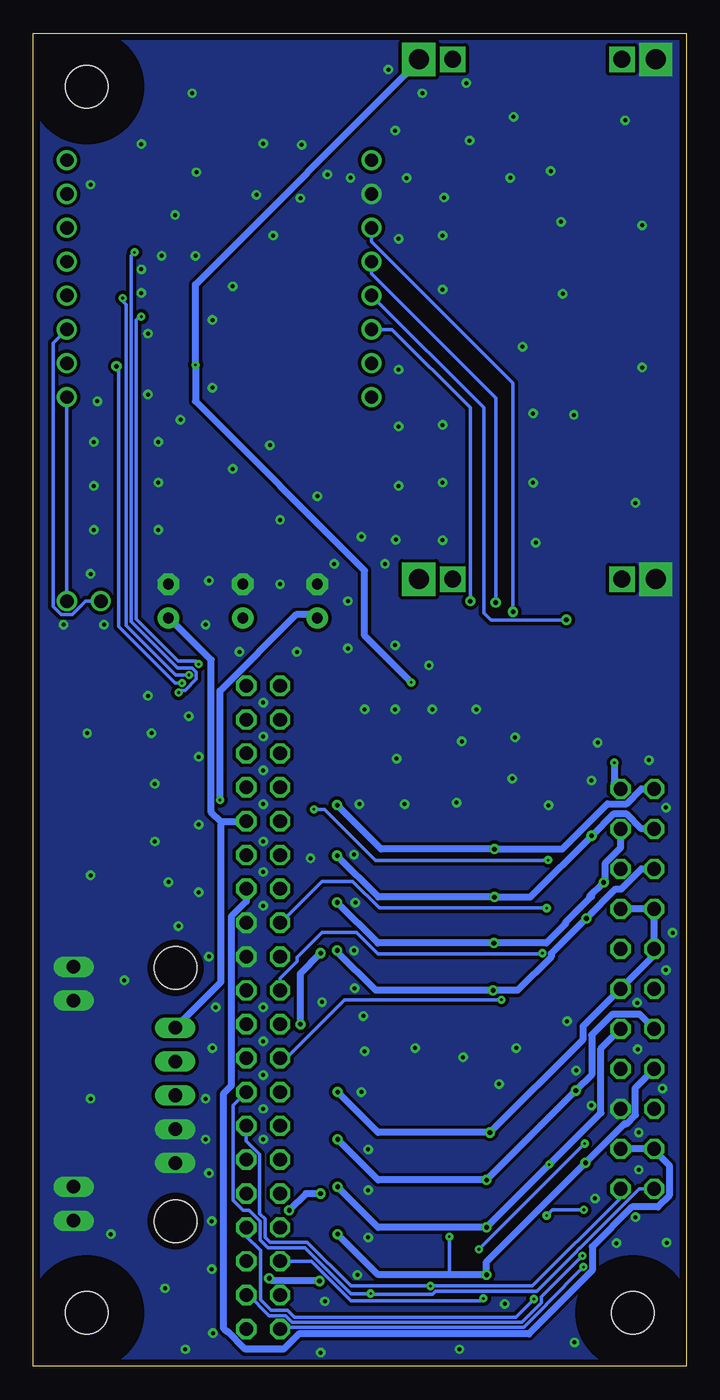
[diagram p6: board, bottom side, seen from below]

Size 49 x 100 mm. Coordinates in mm from the lower left corner, seen from the top.
Outline: 0,100 0,0 49,0 49,100 0,100
Copper layers (1*16): Top 0.035mm / dielectric 1.5mm / Bottom 0.035mm
Design rules "default *": minimum track width 11mil, minimum drill 0.2mm, track to track 4mil, track to pad 4mil, pad to pad 4mil, via to via 4mil, smd to smd 4mil, copper to edge 20mil, drill to drill 6mil, minimum pad ring 10mil, minimum via ring 8mil, stop-mask expansion 4mil, vias tented up to drill 20mil, thermal gap 10mil
Holes 3.2 mm at 38.31,29.88 38.31,10.88

### Footprints (pad centres in the part's own frame; a part is rotated, then mirrored left to right if it is on the bottom)
E2,5-6 = drill 0.813 pad 1.6: + -1.27,0 | drill 0.813 pad 1.6 octagon: - 1.27,0
C1206 = smd 1.6 x 1.8: 1 -1.4,0; 2 1.4,0
C0402 = smd 0.7 x 0.9: 1 -0.65,0; 2 0.65,0
SODFL3616X135N = smd 0.74 x 1.07: 1 -1.775,0; 2 1.775,0
3,2 = hole 3.2: 0,0
1X02 = drill 1.016: 1 -1.27,0; 2 1.27,0
2X20 = drill 1.016 octagon: 1 -24.13,-1.27; 2 -24.13,1.27; 3 -21.59,-1.27; 4 -21.59,1.27; 5 -19.05,-1.27; 6 -19.05,1.27; 7 -16.51,-1.27; 8 -16.51,1.27; 9 -13.97,-1.27; 10 -13.97,1.27; 11 -11.43,-1.27; 12 -11.43,1.27; 13 -8.89,-1.27; 14 -8.89,1.27; 15 -6.35,-1.27; 16 -6.35,1.27; 17 -3.81,-1.27; 18 -3.81,1.27; 19 -1.27,-1.27; 20 -1.27,1.27; 21 1.27,-1.27; 22 1.27,1.27; 23 3.81,-1.27; 24 3.81,1.27; 25 6.35,-1.27; 26 6.35,1.27; 27 8.89,-1.27; 28 8.89,1.27; 29 11.43,-1.27; 30 11.43,1.27; 31 13.97,-1.27; 32 13.97,1.27; 33 16.51,-1.27; 34 16.51,1.27; 35 19.05,-1.27; 36 19.05,1.27; 37 21.59,-1.27; 38 21.59,1.27; 39 24.13,-1.27; 40 24.13,1.27
2X11_MEB12S = drill 1.016 octagon: 1_TOTAL+ 15,-1.27; 2_TOTAL+2 15,1.27; 3_C10+ 12,-1.27; 4_C11+ 12,1.27; 5_C8+ 9,-1.27; 6_C9+ 9,1.27; 7_C6+ 6,-1.27; 8_C7+ 6,1.27; 9 3,-1.27; 10_C5+ 3,1.27; 11_C4+ 0,-1.27; 12 0,1.27; 13_C2+ -3,-1.27; 14_C3+ -3,1.27; 15_TOTAL- -6,-1.27; 16_C1+ -6,1.27; 17_TOTAL- -9,-1.27; 18 -9,1.27; 19_THERMO1_IN -12,-1.27; 20_THERMO2_IN -12,1.27; 21_THERMO1_OUT -15,-1.27; 22_THERMO2_OUT -15,1.27
1X05 = drill 1.016 long: 1 -5.08,0; 2 -2.54,0; 3 0,0; 4 2.54,0; 5 5.08,0
1X02' = drill 1.016 long: 1 -1.27,0; 2 1.27,0
CHIPLED_0603 = smd 0.8 x 0.8: A 0,-0.75; C 0,0.75
SOT96P237X111-3N = smd 1 x 0.6: 1 -1.2,0.955; 2 -1.2,-0.955; 3 1.2,0
R0603 = smd 1 x 1.1: 1 -0.85,0; 2 0.85,0
R0402 = smd 0.7 x 0.9: 1 -0.65,0; 2 0.65,0
R1206 = smd 1.6 x 1.803: 1 -1.422,0; 2 1.422,0
DC-DC-STEP-DOWN-LM2596HVS = drill 1.5 pad 2.5 square: IN+ 0,17.78; IN- 0,0; OUT+ 39,17.78; OUT- 39,0 | drill 1.27 pad 1.676 square: P$1 0,15.24; P$6 0,2.54; P$7 39,15.24; P$8 39,2.54
WEMOS-D1-MINI = drill 1: JP1.1 -11.43,9.525; JP1.2 -11.43,6.985; JP1.3 -11.43,4.445; JP1.4 -11.43,1.905; JP1.5 -11.43,-0.635; JP1.6 -11.43,-3.175; JP1.7 -11.43,-5.715; JP1.8 -11.43,-8.255; JP2.1 11.43,9.525; JP2.2 11.43,6.985; JP2.3 11.43,4.445; JP2.4 11.43,1.905; JP2.5 11.43,-0.635; JP2.6 11.43,-3.175; JP2.7 11.43,-5.715; JP2.8 11.43,-8.255

### Placement (x,y rotation side)
C1  27.69,57.4 90 top
C2  33.27,57.4 90 top
C3  38.86,57.4 90 top
C4  36.58,35.56 270 top
C5  16.76,4.83 180 top
C6  9.4,6.86 180 top
C7  9.4,10.41 180 top
C8  9.4,17.53 180 top
C9  9.4,13.97 180 top
C12  9.4,28.19 180 top
C13  9.4,31.75 180 top
C14  9.4,35.31 180 top
C15  9.4,38.86 180 top
C18  36.58,40.64 270 top
C19  36.58,45.72 90 top
C20  24.38,52.07 270 top
D2  12.88,86.2 0 top
D3  10.37,3.76 180 top
H1  4.02,4.02 0 top
H2  44.98,4.02 0 top
H3  44.98,95.98 0 top
JP3  45.21,57.4 0 top
JP5  31.75,26.92 270 top
JP7  3.67,28.31 90 top
JP9  38.35,20.32 270 top
JP10  [1X02']  45.97,28.7 90 top
JP11  [1X02']  45.97,12.19 270 top
LED1  6.93,49.21 180 top
LED2  8.96,49.21 180 top
LED3  10.99,49.21 180 top
LED4  13.02,49.21 180 top
LED5  21.84,6.86 90 top
LED6  21.84,10.41 90 top
LED7  21.84,17.53 90 top
LED8  21.84,13.97 90 top
LED12  21.84,28.19 90 top
LED13  21.84,31.75 90 top
LED14  21.84,35.31 90 top
LED15  21.84,38.86 90 top
Q2  25.02,8.13 180 top
Q3  25.02,11.68 180 top
Q4  25.02,18.8 180 top
Q5  25.02,15.24 180 top
Q8  25.02,29.46 180 top
Q9  25.02,33.02 180 top
Q10  25.02,36.58 180 top
Q11  25.02,40.13 180 top
R1  38.86,81.53 180 top
R2  38.86,79.5 180 top
R3  16.76,3.56 180 top
R4  10.41,8.38 0 top
R5  43.43,76.2 180 top
R6  43.43,84.07 180 top
R7  15.49,8.38 0 top
R8  20.57,8.38 0 top
R9  22.1,51.31 180 top
R10  27.47,7.93 90 top
R11  19.18,6.86 180 top
R12  12.45,6.86 0 top
R14  10.41,11.94 0 top
R15  37.85,75.95 270 top
R16  35.81,75.95 90 top
R17  28.5,20 90 top
R18  26.4,21.8 180 top
R20  15.49,11.94 0 top
R21  20.57,11.94 0 top
R22  27.43,11.43 270 top
R23  19.18,10.41 180 top
R24  12.45,10.41 0 top
R25  10.41,19.05 0 top
R26  15.49,19.05 0 top
R27  20.57,19.05 0 top
R28  27.43,18.54 270 top
R29  19.18,17.53 180 top
R30  12.45,17.53 0 top
R31  10.41,15.49 0 top
R32  15.49,15.49 0 top
R33  20.57,15.49 0 top
R34  27.43,14.99 270 top
R35  19.18,13.97 180 top
R36  12.45,13.97 0 top
R37  27.91,44.38 90 top
R38  27.12,46.49 180 top
R49  10.41,29.72 0 top
R50  15.49,29.72 0 top
R51  20.57,29.72 0 top
R52  27.43,29.21 270 top
R53  6.93,53.78 90 top
R54  8.96,53.78 90 top
R55  10.99,53.78 90 top
R56  13.02,53.78 90 top
R57  20.32,3.3 90 top
R58  22.61,3.3 90 top
R61  43.43,78.74 180 top
R62  43.43,81.28 180 top
R63  19.18,28.19 180 top
R64  12.45,28.19 0 top
R65  10.41,33.27 0 top
R66  15.49,33.27 0 top
R67  20.57,33.27 0 top
R68  27.43,32.77 270 top
R69  19.18,31.75 180 top
R70  12.45,31.75 0 top
R71  10.41,36.83 0 top
R72  15.49,36.83 0 top
R73  20.57,36.83 0 top
R74  27.43,36.32 270 top
R75  19.18,35.31 180 top
R76  12.45,35.31 0 top
R77  10.41,40.39 0 top
R78  15.49,40.39 0 top
R79  20.57,40.39 0 top
R80  27.43,39.88 270 top
R81  19.18,38.86 180 top
R83  12.45,38.86 0 top
U$1  2.29,98.04 270 top
U$2  35.05,82.23 180 top

### Tracks (layer width: path | path; a pad name or v marks a point on that pad's centre or on a via)
5VDC
  Top 0.279: 34.51,42.96 34.64,43.09 | 36.56,44.25 C19.1 | 29.72,54.48 29.84,54.48 | 24.32,90.49 20.32,86.49 20.07,86.23
  Top 0.508: 14.94,86.49 20.32,86.49 | U$2.JP2.8 32.08,90.49 38.01,84.55 R1.2 R2.2 | U$1.OUT+ 21.86,59.04 26.42,54.48 29.72,54.48 | 29.84,54.48 32.7,57.34 37.66,57.34 C3.+ | JP5.10 33.02,41.47 34.51,42.96 | 34.64,43.09 35.8,44.25 36.56,44.25 | JP9.1 JP9.2
  Top 0.813: 20.07,86.23 U$1.OUT+ | 24.32,90.49 U$2.JP2.8 18.93,90.49 14.94,86.49 D2.2
  Bottom 0.279: 34.92,40.83 34.92,40.64
  Bottom 0.508: JP9.1 34.92,28.83 34.92,40.64 | JP5.10 33.08,40.83 34.92,40.83 35.66,41.56 35.66,52.99 38.8,56.13 C3.+
A0IN
  Top 0.279: 37.78,76.71 35.88,76.71 R16.2 | 37.78,76.71 R15.1 | U$2.JP1.2 45.03,73.8 40.69,73.8 37.78,76.71
C0
  Top 0.279: C5.1 17.46,4.64 17.46,3.68 R3.1 17.46,3.37 27.62,3.37 29.34,1.65 33.53,1.65 34.76,2.88 34.76,14.01 33.02,15.75 JP5.30
C1  (via drill 0.2)
  Top 0.279: v11.43,5.04 11.43,6.86
  Top 0.508: C6.1 11.43,6.86 R12.1
  Bottom 0.279: v11.43,5.04 12.78,3.68 29.41,3.68 29.91,4.18 31.14,4.18 31.95,4.99 31.95,8.68 33.02,9.75 JP5.34
C1+  (via drill 0.2, 0.35)
  Top 0.279: C7.2 8.89,10.67 8.89,11.94 R14.1 | v17.78,9.72 18.41,10.35 R23.2
  Top 0.508: D3.1 12.14,5.03 13.21,6.1 13.21,6.75 R12.2 v14.99,6.86 | v26.16,9.91 26.22,9.85 Q2.2 | R14.1 7.6,13.33 7.6,15.3 v7.56,15.26
  Bottom 0.279: 17.78,6.86 v17.78,9.72
  Bottom 0.508: v26.16,9.91 23.11,6.86 17.78,6.86 v14.99,6.86 14.99,7.84 v7.56,15.26 4.63,18.19 4.47,18.19 3.82,18.84 3.82,20.89 JP7.16_C1+
C1-
  Top 0.279: R11.2 17.46,6.86 16.19,5.59 16.19,4.95 C5.2 16.19,4.64 16.19,3.68 R3.2 15.88,3.37 13.65,3.37 13.21,2.92 9.97,2.92 8.89,4 D3.2 | 8.59,5.44 6.12,7.92 6,8.03 6,21.24 JP7.15_TOTAL-
  Top 0.508: D3.2 8.59,5.44 8.59,6.7 C6.2 8.75,8.14 R4.1
C2  (via drill 0.2)
  Top 0.279: C7.1 9.84,10.35 9.21,9.72 8.26,9.72 7.94,9.4 7.94,8.3 7.95,8.29 v7.79,8.29
  Top 0.508: C7.1 R24.1
  Bottom 0.279: JP5.38 32.93,5.43 31.3,3.8 30.06,3.8 29.57,3.3 12.34,3.3 10.89,4.75 10.89,5.19 v7.79,8.29
C2+  (via drill 0.2, 0.35)
  Top 0.279: C9.2 8.89,14.16 8.89,15.43 R31.1 | R35.2 18.41,13.84 16.51,13.84 15.54,12.87 15.54,10.97 v14.99,10.41
  Top 0.508: R24.2 v14.99,10.41 | v26.16,13.46 26.22,13.4 Q3.2 | R31.1 9.91,15.49 v10.28,15.13
  Bottom 0.279: v10.28,15.13 v10.27,15.13 10.06,15.34
  Bottom 0.508: v26.16,13.46 23.11,10.41 v14.99,10.41 v10.27,15.13 | 10.06,15.34 6.4,19 6.4,23.84 JP7.13_C2+
C3  (via drill 0.2)
  Top 0.279: v10.48,11.3 10.48,13.97 | v7.68,11.73 7.05,11.1 7.05,8.11 v7.7,7.45
  Top 0.508: C9.1 10.48,13.97 R36.1
  Bottom 0.279: v10.48,11.3 10.05,11.73 v7.68,11.73 | JP5.39 30.48,2.73 30.29,2.92 12.18,2.92 10.51,4.6 10.51,4.65 v7.7,7.45
C3+  (via drill 0.35)
  Top 0.279: C8.2 8.89,17.65 8.89,18.92 R25.1 | R29.2 18.41,17.34 16.51,17.34 15.44,16.27 15.44,14.31 v14.99,13.97
  Top 0.508: R36.2 v14.99,13.97 | v26.16,17.02 26.22,16.96 Q5.2 | R25.1 8.99,20.01 8.3,20.7 v8.28,20.68
  Bottom 0.508: v26.16,17.02 23.11,13.97 v14.99,13.97 v8.28,20.68 7.08,21.87 7.08,24.84 5.5,26.43 3.51,26.43 JP7.14_C3+
C4  (via drill 0.2)
  Top 0.279: v7.62,16.7 9.21,16.7 9.84,17.34 C8.1 | v15.56,8.76 15.56,7.49 15.68,7.37 15.68,5.71 15.21,5.24 v15.21,5.08
  Top 0.508: C8.1 R30.1
  Bottom 0.279: v15.56,8.76 v7.62,16.7 | JP5.35 28.13,7.87 25.16,4.9 15.39,4.9 v15.21,5.08
C4+  (via drill 0.35)
  Top 0.279: R63.2 18.41,28.13 17.18,26.9 8.99,26.9 7.58,28.31 | R18.2 25.74,21 v26.16,20.57 | 26.22,20.52 Q4.2
  Top 0.406: JP7.5_C8+ JP7.7_C6+
  Top 0.508: v26.16,20.57 26.22,20.52 | JP7.11_C4+ 7.58,28.31 R49.1 8.99,28.44 C12.2 | v14.73,17.53 R30.2
  Bottom 0.508: v26.16,20.57 23.11,17.53 v14.73,17.53 7.72,24.54 7.72,25.52 JP7.11_C4+ 2.4,30.85 JP7.10_C5+ JP7.8_C7+ JP7.7_C6+
C5
  Top 0.279: R17.1 29.3,18.55 29.3,17.4 30.2,16.5 30.9,16.5 31.6,15.79 31.6,14.22 30.48,13.1 JP5.31
C5+  (via drill 0.35)
  Top 0.279: R69.2 16.91,31.75 15.5,30.34 15.5,29.1 14.97,28.57 14.88,28.57 v14.5,28.2
  Top 0.508: v14.5,28.2 R64.2 | v7.5,33.6 7.83,33.27 R65.1 8.99,31.99 C13.2 | v26.2,31.2 26.22,31.18 Q8.2
  Bottom 0.508: JP7.6_C9+ 3.35,37.31 4.87,35.79 5.31,35.79 v7.5,33.6 10.14,30.96 10.14,30.71 12.65,28.2 v14.5,28.2 23.3,28.2 26.2,31.1 v26.2,31.2
C6
  Top 0.279: JP5.27 30.48,18.67 R17.2 28.2,20.65 R18.1
C6+  (via drill 0.35)
  Top 0.279: v14.43,31.75 15.03,31.75 15.57,32.29 15.57,33.98 16.91,35.31 R75.2
  Top 0.508: v14.43,31.75 R70.2 | v26.2,34.8 26.22,34.78 Q9.2 | C14.2 8.99,35.55 R71.1 6.63,36.83 6.2,36.4 v6.2,36.3
  Bottom 0.508: JP7.3_C10+ 4.94,38.89 6.05,37.77 6.05,36.44 v6.2,36.3 7.26,35.23 7.1,35.23 9.05,33.28 9.05,33.19 10.49,31.75 v14.43,31.75 23.15,31.75 v26.2,34.8
C7  (via drill 0.2)
  Top 0.279: v13.87,27.5 12.38,27.5 12.06,27.81 12.06,28.13 R64.1
  Top 0.508: C12.1 R64.1
  Bottom 0.279: v13.87,27.5 13.9,27.47 25.66,27.47 30.48,22.65 JP5.23
C7+  (via drill 0.35)
  Top 0.279: R81.2 16.91,38.86 15.5,37.46 15.5,36.22 14.97,35.69 14.89,35.69 v14.4,35.2 | R77.1 8.99,39.8
  Top 0.508: v14.4,35.2 13.2,35.2 R76.2 | v7.1,39.8 8.99,39.8 | R77.1 8.99,39.11 C15.2 | v26.2,38.3 26.22,38.3 Q10.2
  Bottom 0.508: JP7.4_C11+ 3.35,40.31 4.47,41.43 5.47,41.43 v7.1,39.8 11.7,35.2 v14.4,35.2 23.1,35.2 v26.2,38.3
C8  (via drill 0.2)
  Top 0.279: v10.79,30.99 10.79,31.75
  Top 0.508: C13.1 10.79,31.75 R70.1
  Bottom 0.279: v10.79,30.99 10.86,30.92 23.11,30.92 24.75,32.56 27.32,32.56 29.21,30.67 29.21,30.35 30.48,29.08 JP5.19
C8+  (via drill 0.35)
  Top 0.508: R83.2 14.4,38.86 v14.4,38.8 | Q11.2 26.22,42.08 v26.2,42.1 26.2,46.24 26.41,46.45 26.42,46.45 R38.2
  Bottom 0.508: v26.2,42.1 22.9,38.8 v14.4,38.8 9.3,38.8 5.91,42.19 4.47,42.19 3.35,43.31 JP7.2_TOTAL+2
C9  (via drill 0.2)
  Top 0.279: v10.48,34.36 10.48,34.66 10.16,34.98 10.16,35.12 C14.1
  Top 0.508: C14.1 R76.1
  Bottom 0.279: v10.48,34.36 23.03,34.36 25.04,36.37 27.32,36.37 30.48,33.21 JP5.15
C10  (via drill 0.2)
  Top 0.279: v10.36,37.97 10.36,38.15 C15.1 | v27.94,41.78 30.48,39.24 JP5.11
  Top 0.508: C15.1 R83.1
  Bottom 0.279: v10.36,37.97 10.66,37.97 10.68,37.96 23.31,37.96 27.14,41.78 v27.94,41.78
C11
  Top 0.279: JP5.7 28.21,43.43 R37.1
C12
  Top 0.279: R37.2 27.91,46.37 27.88,46.38 R38.1 29.56,48.51 JP5.3
CSB  (via drill 0.2)
  Top 0.279: JP5.8 33.02,44.2 34.54,45.72 34.54,47.66 37.43,50.55 v38.1,50.55 | v41.4,83.57 41.91,84.07 R6.2
  Bottom 0.279: v38.1,50.55 37.95,50.7 37.62,50.7 36.77,51.55 36.77,52.08 37.09,52.4 38.17,52.4 41.66,55.88 41.66,83.31 v41.4,83.57
GND  (via drill 0.3)
  Top 0.508: 1.18,57.94 U$1.OUT- | C1.- C2.- C3.-
  other vias: 25.4,53.85 29.21,53.59 25.4,57.4 21.84,54.1 22.61,60.2 33.53,53.59 36.07,55.63 35.81,58.93 30.48,58.67 43.69,55.63 46.74,55.63 44.7,59.44 44.45,62.74 44.45,66.04 44.45,69.34 39.62,69.34 39.62,66.29 39.62,62.74 30.48,63.5 34.04,67.31 37.95,71.01 35.56,73.41 31.24,69.09 27.69,65.28 24.38,62.23 26.42,60.2 30.99,84.84 34.04,81.03 35.56,78.49 36.83,83.31 39.37,83.31 38.35,86.36 36.76,89.58 32.26,87.88 40.89,82.3 40.89,80.52 40.39,77.47 40.39,72.9 44.2,72.39 21.59,84.58 21.59,74.77 21.59,70.5 21.59,66.04 21.79,62.01 18.29,66.29 18.29,70.61 18.29,80.77 18.29,84.84 18.29,61.98 18.16,87.68 20.99,89.14 13.21,89.15 16.26,91.95 19.81,95.5 16.51,96.27 12.95,93.73 10.16,89.66 9.4,85.85 21.84,92.71 31.75,91.73 22.35,97.28 26.92,89.41 25.19,89.16 28.86,91.63 28.96,87.63 37.34,48.77 36.58,45.72 36.58,40.64 36.58,35.56 31.75,47.24 31.75,49.78 31.75,44.7 31.75,42.16 31.75,39.37 31.75,37.08 31.75,34.54 31.75,26.92 31.75,24.38 31.75,21.84 31.75,19.3 31.75,17.02 36.07,20.07 36.07,17.02 35.81,14.48 35.56,23.88 35.31,26.92 35.81,30.73 38.1,33.02 39.88,39.37 39.88,43.69 40.13,47.5 40.39,50.29 38.86,36.32 24.38,20.57 24.13,23.62 24.23,26.28 23.88,16.26 23.88,13.21 23.88,9.65 19.3,52.58 2.79,45.47 15.75,49.28 19.05,49.28 21.84,49.28 24.13,49.28 28.19,38.1 7.11,43.94 3.56,17.53 1.78,20.83 3.56,14.73 3.81,11.18 1.47,9.27 5.24,9.24 1.52,41.91 1.52,29.72 1.02,32.51 3.68,27.27 7.11,19.56 8.38,1.78 17.02,1.27 27.43,1.02 37.59,1.27 39.12,5.84 43.18,9.91 44.7,20.07 42.16,28.96 44.7,36.83 44.96,47.5 3.81,64.77 8.43,71.37 3.3,74.93 9.26,80.46 3.3,85.6 4.57,93.47 37.08,95.5 40.89,91.69 44.7,88.65 11.29,61.78 11.49,66.28 11.49,71.48 12.29,76.48 27.33,27.32 24.93,31.18 16.85,46.88 13.05,44.08 12.85,47.18 6.65,46.78 8.95,25.88 16.75,23.18 12.75,23.88 20.35,23.88 14.05,21.18 8.25,22.18 3.65,23.78 6.85,12.58 35.61,10.88 35.61,7.28 35.51,2.48 27.12,4.87 13.62,4.67 24.68,6.85 24.88,28.35 24.83,34.78 24.93,38.38 24.53,42.18 21.13,42.18 21.73,45.58 17.23,42.28 10.33,42.08
  pour Bottom (isolate 0.254, no thermals): -0.15,-0.25 49.28,-0.25 49.28,100.33 -0.15,100.33
  pour Top (isolate 0.2, no thermals): -0.25,100.33 49.28,100.33 49.28,-0.25 -0.25,-0.25
ISIGNAL
  Top 0.279: JP5.24 33.02,23.05 34.61,23.05 37.15,20.51 38.1,20.51 JP9.3
MISO  (via drill 0.2)
  Top 0.279: JP5.2 34.98,51.05 v36.6,52.67 | R61.2 v40.89,78.74 40.13,79.5 R2.1
  Bottom 0.279: v36.6,52.67 36.81,52.89 38.13,52.89 41.27,56.04 41.27,78.49 41.02,78.74 v40.89,78.74
MOSI  (via drill 0.2)
  Top 0.279: JP5.4 34.29,48.51 37.31,51.54 v37.31,51.85 | v42.29,80.14 42.29,80.99 R62.2 42.33,81.53 R1.1
  Bottom 0.279: v37.31,51.85 38.33,51.85 42.04,55.56 42.04,79.63 42.42,80.01 v42.29,80.14
N$1
  Top 0.279: LED1.A R53.1
N$2
  Top 0.279: LED2.A R54.1
N$3
  Top 0.279: LED3.A R55.1
N$4
  Top 0.279: LED4.A R56.1
N$5
  Bottom 0.279: JP3.2 U$2.JP1.1
N$6
  Bottom 0.279: JP3.1 45.06,57.4 46.07,56.4 46.9,56.4 47.5,57 47.5,76.77 U$2.JP1.3
N$7
  Top 0.279: U$2.JP1.4 46.48,79.4 44.28,77.2 R5.1
N$8
  Top 0.508: R7.1 R4.2
N$9
  Top 0.508: R8.1 R7.2
N$10
  Top 0.279: 22.23,8.13 22.54,7.81 22.54,6.86 LED5.A | 22.23,8.13 Q2.3 | 22.23,8.13 R8.2
N$11
  Top 0.279: Q2.1 27.47,8.42 R10.2
N$12
  Top 0.508: LED5.C R11.1
N$13
  Top 0.508: R14.2 R20.1
N$14
  Top 0.508: R20.2 R21.1
N$15
  Top 0.279: U$2.JP1.7 46.48,87.77 44.28,85.57 R6.1
N$16
  Top 0.279: 22.54,11.62 22.54,10.67 LED6.A | 22.54,11.62 22.23,11.94 R21.2 22.54,11.62 | 22.54,11.62 23.81,11.62 Q3.3
N$19
  Top 0.279: R22.2 27.3,10.67 26.35,10.67 Q3.1
N$20
  Top 0.508: LED6.C R23.1
N$21
  Top 0.508: R25.2 R26.1
N$22
  Top 0.508: R27.1 R26.2
N$23
  Top 0.279: 22.23,18.92 22.54,18.61 22.54,17.65 LED7.A | 22.23,18.92 23.81,18.92 Q4.3 | 22.23,18.92 R27.2
N$24
  Top 0.279: R28.2 27.3,17.97 26.35,17.97 Q4.1
N$26
  Top 0.508: R29.1 LED7.C
N$27
  Top 0.508: R31.2 R32.1
N$28
  Top 0.508: R32.2 R33.1
N$29
  Top 0.279: LED8.A 22.54,14.16 22.54,15.11 22.23,15.43 R33.2 22.23,15.75 22.86,15.11 23.81,15.11 Q5.3
N$30  (via drill 0.35)
  Top 0.279: v13,56.6 13,54.66 R56.2
  Bottom 0.279: v13,56.6 13,73.74 23.62,84.36 U$2.JP2.6
N$31
  Top 0.279: R34.2 27.3,14.16 26.35,14.16 Q5.1
N$32
  Top 0.508: LED8.C R35.1
N$43
  Top 0.508: R49.2 R50.1
N$44
  Top 0.508: R51.1 R50.2
N$45
  Top 0.279: 22.54,29.4 22.54,28.45 LED12.A | 22.54,29.4 22.23,29.72 R51.2 22.54,29.4 | 22.54,29.4 23.81,29.4 Q8.3
N$46
  Top 0.279: R52.2 27.3,28.45 26.35,28.45 Q8.1
N$47
  Top 0.508: LED12.C R63.1
N$48
  Top 0.508: R65.2 R66.1
N$49
  Top 0.508: R67.1 R66.2
N$50
  Top 0.279: LED13.A 22.54,31.94 22.54,32.89 22.23,33.21 R67.2 22.23,33.53 22.86,32.89 23.81,32.89 Q9.3
N$51
  Top 0.279: R68.2 27.3,31.94 26.35,31.94 Q9.1
N$52
  Top 0.508: R69.1 LED13.C
N$53
  Top 0.508: R71.2 R72.1
N$54
  Top 0.508: R72.2 R73.1
N$55
  Top 0.279: 22.23,36.7 22.54,36.39 22.54,35.43 LED14.A | 22.23,36.7 23.81,36.7 Q10.3 | 22.23,36.7 R73.2
N$56
  Top 0.279: R74.2 27.3,35.75 26.35,35.75 Q10.1
N$57
  Top 0.508: LED14.C R75.1
N$58
  Top 0.508: R77.2 R78.1
N$59
  Top 0.508: R79.1 R78.2
N$60
  Top 0.279: 22.23,40.2 22.54,39.88 22.54,38.92 LED15.A | 22.23,40.2 23.81,40.2 Q11.3 | 22.23,40.2 R79.2
N$61
  Top 0.279: R80.2 27.3,39.24 26.35,39.24 Q11.1
N$62
  Top 0.508: R81.1 LED15.C
N$70  (via drill 0.35)
  Top 0.279: R53.2 7.76,53.8 13.9,53.8 16.2,56.1 v16.2,57.4
  Bottom 0.279: U$2.JP2.3 22.07,77.79 16.2,71.92 v16.2,57.4
N$73
  Top 0.279: U$2.JP1.5 46.48,82.04 44.28,79.84 R61.1
N$119
  Top 0.279: R62.1 45.49,82.48 45.49,83.28 46.48,84.28 U$2.JP1.6
N$120  (via drill 0.35)
  Top 0.279: v14.3,57.3 11.6,57.3 10.99,56.69 R55.2
  Bottom 0.279: U$2.JP2.5 23.62,81.97 14.3,72.64 v14.3,57.3
N$124  (via drill 0.35)
  Top 0.279: v9,56 9,54.67 R54.2
  Bottom 0.279: U$2.JP2.4 15.2,71.91 15.2,56.52 14.66,55.98 9.02,55.98 v9,56
S1  (via drill 0.35)
  Top 0.508: R10.1 27.6,7.14 27.6,6.47 v27.51,6.39 | v31.3,6.6 31.46,6.76 33.48,6.76 34.2,7.47 34.2,11.8 33.05,12.95 JP5.32
  Bottom 0.508: v27.51,6.39 27.58,6.45 31.15,6.45 v31.3,6.6
S2  (via drill 0.35)
  Top 0.508: R22.1 27.43,12.77 27.35,12.85 v27.45,12.95 | JP5.36 33.02,8.48 31.6,9.9 31.6,10.88 30.94,11.53 29.97,11.53 v29.8,11.7
  Bottom 0.508: v27.45,12.95 28.55,12.95 v29.8,11.7
S3
  Top 0.508: R34.1 27.53,15.64 28.3,14.87 28.3,5.7 30,4 31.9,4 33.02,2.88 JP5.40
S4
  Top 0.508: R28.1 27.69,18.93 27.69,18.85 27.9,18.64 28.3,18.64 28.8,18.14 28.8,16.43 28.91,16.32 28.91,6.91 JP5.37
S7  (via drill 0.35)
  Top 0.508: JP5.25 28.96,22.1 v28.96,25.65 | v27.43,30.99 R52.1
  Bottom 0.508: v28.96,25.65 28.96,29.46 v27.43,30.99
S8
  Top 0.508: JP5.21 28.75,27.38 28.75,32.51 27.85,33.42 R68.1
S9
  Top 0.508: JP5.17 29.36,31.85 29.36,35.81 28.2,36.97 R74.1
S10
  Top 0.508: JP5.13 29.36,36.93 29.36,38.82 29.44,38.89 27.8,40.53 R80.1
SCK  (via drill 0.2, 0.35)
  Top 0.279: v37.85,51.24 37.59,51.24 33.02,46.67 JP5.6 | v42.76,75.02 42.58,75.2 R5.2
  Bottom 0.279: v37.85,51.24 38.35,51.24 42.61,55.5 42.61,74.93 42.67,74.93 v42.76,75.02
V+
  Top 0.279: R9.1 24.13,51.31 C20.2 24.45,51.31 30.48,51.31 JP5.1
VIN  (via drill 0.2)
  Top 0.279: v20.64,51.31 R9.2 | D2.1 11.11,86.23 11.11,88.46 20,97.35 20,97.98 U$1.IN+ | v36.83,75.12 37.78,75.12 R15.2
  Top 0.508: v20.64,51.31 19.1,51.31 13.06,45.28 v5.4,45.28
  Bottom 0.279: 20,97.98 U$1.IN+
  Bottom 0.508: v20.64,51.31 24.13,54.8 24.13,59.69 36.83,72.39 v36.83,75.12 36.83,81.15 20,97.98 | v5.4,45.28 5.4,43.77 JP7.1_TOTAL+
VREF1  (via drill 0.2)
  Top 0.279: 36.51,41.78 C18.1
  Top 0.508: JP5.12 36.45,41.78 36.51,41.78 | C18.1 35.43,42.04 v34.99,42.48
  Bottom 0.508: v34.99,42.48 34.99,50.67 29.27,56.39 27.94,56.39 C1.+
VREF2
  Top 0.279: 33.02,35.75 JP5.14 | 36.51,37.02 C4.1
  Top 0.508: C2.+ 36.07,53.33 36.87,53.33 38.76,51.45 38.76,39.22 37.62,38.08 37.58,38.08 36.51,37.02 | C4.1 34.23,36.96 33.02,35.75
  Bottom 0.279: 34.61,2.73 34.48,2.6
  Bottom 0.508: JP5.14 33.02,34.85 34.14,33.74 34.14,21.04 34.75,20.43 34.75,2.87 34.61,2.73 | 34.48,2.6 34.41,2.6 33.09,1.28 30.21,1.28 29.07,2.43 11.8,2.43 7.04,7.18 7.04,8.96 4.06,11.94 2.12,11.94 1.28,12.78 1.28,15.07 2.4,16.19 JP7.20_THERMO2_IN JP7.19_THERMO1_IN
VTEMP1  (via drill 0.2)
  Top 0.279: R57.2 19.19,5.28 v19.19,6.01
  Bottom 0.279: JP7.21_THERMO1_OUT 4.94,12.61 11.53,6.01 v19.19,6.01 25.18,6.01 28.44,9.28 31.24,9.28 31.62,9.66 31.62,11.04 32.02,11.44 32.02,15.91 33.02,16.91 JP5.28
VTEMP2  (via drill 0.2)
  Top 0.279: R58.2 23.79,5.34 v23.68,5.45
  Bottom 0.279: JP7.22_THERMO2_OUT 3.52,13.31 7.99,8.83 8.01,8.83 8.33,8.51 8.33,8.49 11.19,5.63 18.8,5.63 19.04,5.39 23.62,5.39 v23.68,5.45 25.15,5.45 28.6,8.9 31.4,8.9 32,9.5 32,10.88 32.8,11.68 33.27,11.68 34.02,12.43 34.02,19.57 JP5.26

### Text on the board
tNames: V+ | EasyBMS / MEB8S / v1.3 / 13.04.2022 | 8S